# Altium schematic sheet 5.Teensy.SchDoc
size A; DocumentNumber: 5; SheetNumber: 5; SheetTotal: 6
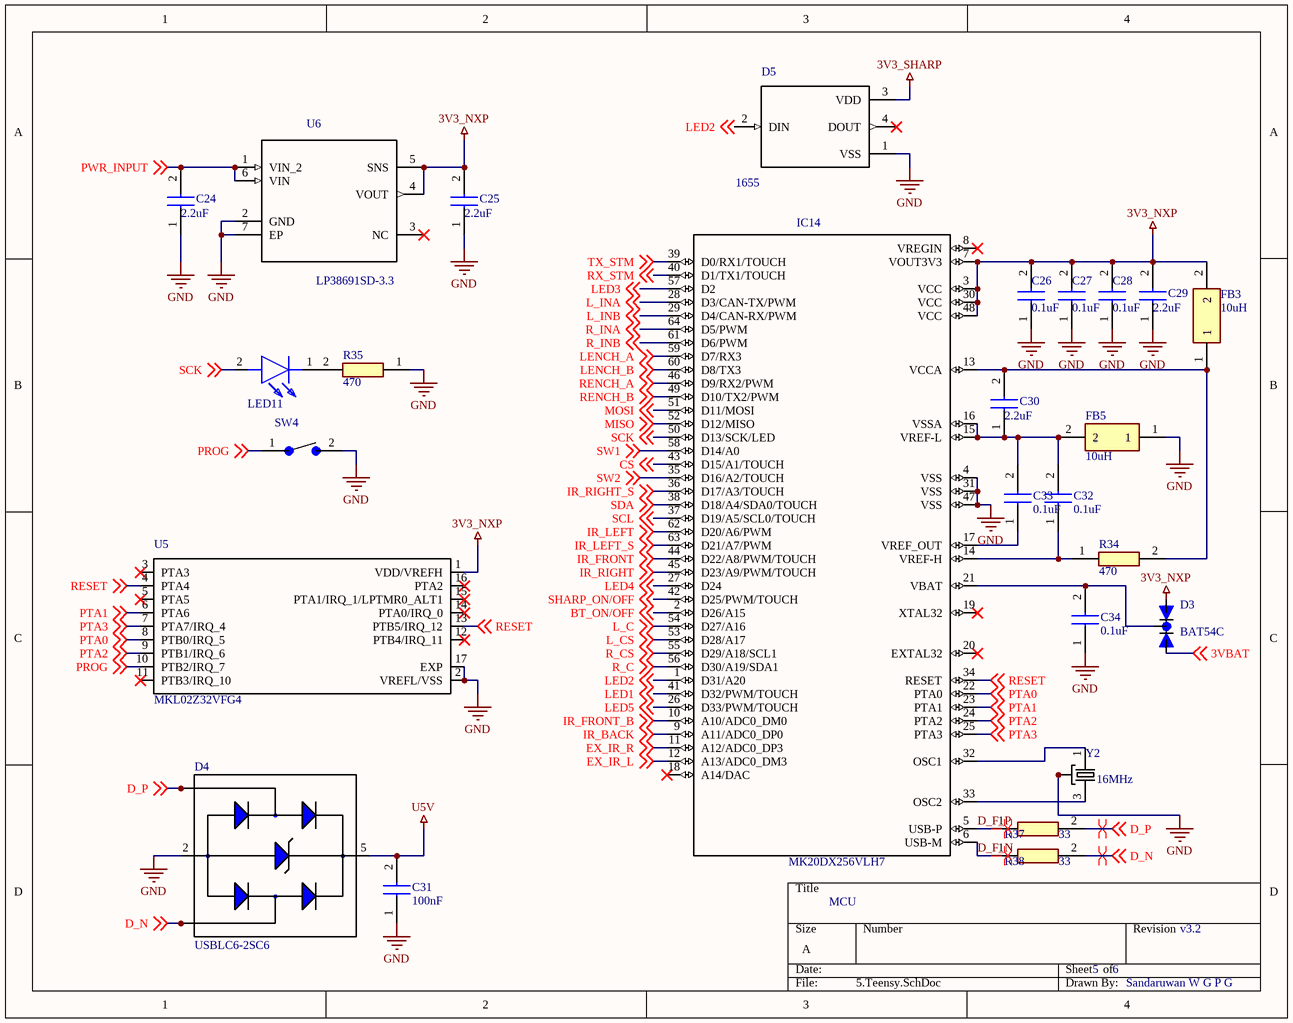
[diagram p0: 5.Teensy.SchDoc]

## Parts
C24  value 2.2uF  [CAPC2012X94N]  (hidden comment: 08055A101JAT2A)
C25  value 2.2uF  [CAPC2012X94N]  (hidden comment: 08055A101JAT2A)
C26  value 0.1uF  [*CAPC1608X95N]  (hidden comment: capacitor 0603)
C27  value 0.1uF  [*CAPC1608X95N]  (hidden comment: capacitor 0603)
C28  value 0.1uF  [*CAPC1608X95N]  (hidden comment: capacitor 0603)
C29  value 2.2uF  [CAPC2012X94N]  (hidden comment: 08055A101JAT2A)
C30  value 2.2uF  [CAPC2012X94N]  (hidden comment: 08055A101JAT2A)
C31  value 100nF  [*CAPC1608X95N]  (hidden comment: capacitor 0603)
C32  value 0.1uF  [*CAPC1608X95N]  (hidden comment: capacitor 0603)
C33  value 0.1uF  [*CAPC1608X95N]  (hidden comment: capacitor 0603)
C34  value 0.1uF  [*CAPC1608X95N]  (hidden comment: capacitor 0603)
D3  BAT54C  [*SOT23-R]
D4  USBLC6-2SC6  [*SOT95P280X145-6N]
D5  1655  [*LED_1655]
FB3  value 10uH  [BEADC1608X95N]  (hidden comment: inductor 0603)
FB5  value 10uH  [BEADC1608X95N]  (hidden comment: inductor 0603)
IC14  MK20DX256VLH7  [QFP50P1200X1200X160-64N]
LED11  150080BS75000  [LEDC2012X80N]  (value not drawn)
R34  value 470  [RESC1608X55N]  (hidden comment: resistor)
R35  value 470  [RESC1608X55N]  (hidden comment: resistor)
R37  value 33  [RESC1608X55N]  (hidden comment: resistor)
R38  value 33  [RESC1608X55N]  (hidden comment: resistor)
SW4  1437566-3  [*TE_FSMSM]  (value not drawn)
U5  MKL02Z32VFG4  [*QFN50P300X300X65-17N]
U6  LP38691SD-3.3  [*DFN300X300X80-7N]
Y2  value 16MHz  [*OSCCC320X250X60N]  (hidden comment: NX3225SA-12.000M-STD-CRS-2)

## Nets
3V3_NXP: C25.2 C26.2 C27.2 C28.2 C29.2 D3.2(A2) FB3.2 IC14.3(VCC) IC14.7(VOUT3V3) IC14.30(VCC) IC14.48(VCC) U5.1(VDD/VREFH) U6.4(VOUT) U6.5(SNS)
3V3_SHARP: D5.3(VDD)
GND: C24.1 C25.1 C26.1 C27.1 C28.1 C29.1 C31.1 C34.1 D4.2(GND) D5.1(VSS) FB5.1 IC14.4(VSS) IC14.31(VSS) IC14.47(VSS) R35.1 SW4.2 U5.2(VREFL/VSS) U5.17(EXP) U6.2(GND) U6.7(EP) Y2.2(GND) Y2.4(GND)
U5V: C31.2 D4.5(VBUS)
3VBAT: D3.1(A1) ; off-sheet 3VBAT
BT_ON/OFF: IC14.2(D26/A15) ; off-sheet BT_ON/OFF
CS: IC14.43(D15/A1/TOUCH) ; off-sheet CS
D_F_N: IC14.6(USB-M) R38.1
D_F_P: IC14.5(USB-P) R37.1
D_N: D4.3(I/O2) D4.4(I/O2) R38.2 ; off-sheet D_N
D_P: D4.1(I/O1) D4.6(I/O1) R37.2 ; off-sheet D_P
EX_IR_L: IC14.12(A13/ADC0_DM3) ; off-sheet EX_IR_L
EX_IR_R: IC14.11(A12/ADC0_DP3) ; off-sheet EX_IR_R
IR_BACK: IC14.9(A11/ADC0_DP0) ; off-sheet IR_BACK
IR_FRONT: IC14.44(D22/A8/PWM/TOUCH) ; off-sheet IR_FRONT
IR_FRONT_B: IC14.10(A10/ADC0_DM0) ; off-sheet IR_FRONT_B
IR_LEFT: IC14.62(D20/A6/PWM) ; off-sheet IR_LEFT
IR_LEFT_S: IC14.63(D21/A7/PWM) ; off-sheet IR_LEFT_S
IR_RIGHT: IC14.45(D23/A9/PWM/TOUCH) ; off-sheet IR_RIGHT
IR_RIGHT_S: IC14.36(D17/A3/TOUCH) ; off-sheet IR_RIGHT_S
L_C: IC14.54(D27/A16) ; off-sheet L_C
L_CS: IC14.53(D28/A17) ; off-sheet L_CS
L_INA: IC14.28(D3/CAN-TX/PWM) ; off-sheet L_INA
L_INB: IC14.29(D4/CAN-RX/PWM) ; off-sheet L_INB
LED1: IC14.41(D32/PWM/TOUCH) ; off-sheet LED1
LED2: D5.2(DIN) IC14.1(D31/A20) ; off-sheet LED2
LED3: IC14.57(D2) ; off-sheet LED3
LED4: IC14.27(D24) ; off-sheet LED4
LED5: IC14.26(D33/PWM/TOUCH) ; off-sheet LED5
LENCH_A: IC14.59(D7/RX3) ; off-sheet LENCH_A
LENCH_B: IC14.60(D8/TX3) ; off-sheet LENCH_B
MISO: IC14.52(D12/MISO) ; off-sheet MISO
MOSI: IC14.51(D11/MOSI) ; off-sheet MOSI
PROG: SW4.1 U5.10(PTB2/IRQ_7) ; off-sheet PROG
PTA0: IC14.22(PTA0) U5.8(PTB0/IRQ_5) ; off-sheet PTA0
PTA1: IC14.23(PTA1) U5.6(PTA6) ; off-sheet PTA1
PTA2: IC14.24(PTA2) U5.9(PTB1/IRQ_6) ; off-sheet PTA2
PTA3: IC14.25(PTA3) U5.7(PTA7/IRQ_4) ; off-sheet PTA3
PWR_INPUT: C24.2 U6.1(VIN_2) U6.6(VIN) ; off-sheet PWR_INPUT
R_C: IC14.56(D30/A19/SDA1) ; off-sheet R_C
R_CS: IC14.55(D29/A18/SCL1) ; off-sheet R_CS
R_INA: IC14.64(D5/PWM) ; off-sheet R_INA
R_INB: IC14.61(D6/PWM) ; off-sheet R_INB
RENCH_A: IC14.46(D9/RX2/PWM) ; off-sheet RENCH_A
RENCH_B: IC14.49(D10/TX2/PWM) ; off-sheet RENCH_B
RESET: IC14.34(RESET) U5.4(PTA4) U5.13(PTB5/IRQ_12) ; off-sheet RESET
RX_STM: IC14.40(D1/TX1/TOUCH) ; off-sheet RX_STM
SCK: IC14.50(D13/SCK/LED) LED11.2(A) ; off-sheet SCK
SCL: IC14.37(D19/A5/SCL0/TOUCH) ; off-sheet SCL
SDA: IC14.38(D18/A4/SDA0/TOUCH) ; off-sheet SDA
SHARP_ON/OFF: IC14.42(D25/PWM/TOUCH) ; off-sheet SHARP_ON/OFF
SW1: IC14.58(D14/A0) ; off-sheet SW1
SW2: IC14.35(D16/A2/TOUCH) ; off-sheet SW2
TX_STM: IC14.39(D0/RX1/TOUCH) ; off-sheet TX_STM
NetC30_1: C30.1 C32.2 C33.2 FB5.2 IC14.15(VREF-L) IC14.16(VSSA)
NetC30_2: C30.2 FB3.1 IC14.13(VCCA) R34.2
NetC32_1: C32.1 IC14.14(VREF-H) R34.1
NetC33_1: C33.1 IC14.17(VREF_OUT)
NetC34_2: C34.2 D3.3(C) IC14.21(VBAT)
NetIC14_32: IC14.32(OSC1) Y2.1
NetIC14_33: IC14.33(OSC2) Y2.3
NetLED11_1: LED11.1(K) R35.2

Not connected (* = marked no-connect by the designer): D5 4(DOUT)*; IC14 8(VREGIN)* 18(A14/DAC)* 19(XTAL32)* 20(EXTAL32)*; U5 3(PTA3)* 5(PTA5)* 11(PTB3/IRQ_10)* 12(PTB4/IRQ_11)* 14(PTA0/IRQ_0)* 15(PTA1/IRQ_1/LPTMR0_ALT1)* 16(PTA2)*; U6 3(NC)*

## Layout directives
differential pair: D_F_N, D_F_P, D_N, D_P

## Notes on the sheet
- MCU
- v3.2
- Sandaruwan W G P G

## Library data of the parts
C24 C25 C29 C30 = 08055A101JAT2A: Capacitor; Manufacturer_Name: AVX; Allied_Number: 70474488; Datasheet Link: https://componentsearchengine.com/Datasheets/1/06031A100FAT2A.pdf; Height: 0.94mm; Manufacturer_Part_Number: 08055A101JAT2A; Mouser Part Number: 581-08055A101J; Mouser Price/Stock: https://www.mouser.com/Search/Refine.aspx?Keyword=581-08055A101J; RS Part Number: 0391000P; RS Price/Stock: http://uk.rs-online.com/web/p/products/0391000P; Allied Price/Stock: https://www.alliedelec.com/avx-08055a101jat2a/70474488/
C26-C28 C31-C34 = capacitor 0603: Capacitor
D3 = BAT54C: MF: ON Semiconductor; Package: SOT-23-3 ON Semiconductor; Availability: Unavailable; MP: BAT54C; SnapEDA_Link: https://www.snapeda.com/parts/BAT54C/ON%20Semiconductor/view-part/?ref=snap; Price: None; Value: *
D4 = USBLC6-2SC6: USBLC6 Series 2 Line 6 V Uni / Bi-Directional ESD Protection - SOT-23-6; MF: STMicroelectronics; Package: SOT-23-6 STMicroelectronics; Price: None; SnapEDA_Link: https://www.snapeda.com/parts/USBLC6-2SC6/STMicroelectronics/view-part/?ref=snap; MP: USBLC6-2SC6; Availability: Unavailable; Value: *
D5 = 1655: Addressable Lighting Neopixel 10 LED Discrete Serial _Shift Register_ Red, Green, Blue _RGB_ 5.00mm L x 5.00mm W; MF: Adafruit; Digi-Key_Part_Number: 1528-1104-ND; MP: 1655; Package: TO-3 Adafruit; SnapEDA_Link: https://www.snapeda.com/parts/1655/Adafruit%20Industries/view-part/4299409/?ref=snap; Digi-Key_Purchase_URL: https://www.digikey.lk/product-detail/en/adafruit-industries-llc/1655/1528-1104-ND/5154679?utm_source=snapeda&utm_medium=aggregator&utm_campaign=symbol; Value: *
FB3 FB5 = inductor 0603: Ferrite Bead
IC14 = MK20DX256VLH7_1: Kinetis K20: 72MHz Cortex-M4 Performance MCU, 288KB Flash, 64KB SRAM, Full-Speed USB, 64-LQFP; MF: NXP USA; Package: LQFP-64 NXP Semiconductors; Availability: Unavailable; MP: MK20DX256VLH7; SnapEDA_Link: https://www.snapeda.com/parts/MK20DX256VLH7/NXP%20USA%20Inc./view-part/?ref=snap; Price: None; Value: *
LED11 = 150080BS75000: LED; Manufacturer_Name: Wurth Elektronik; Datasheet Link: https://katalog.we-online.com/led/datasheet/150080BS75000.pdf; Height: 0.8mm; Manufacturer_Part_Number: 150080BS75000; Mouser Part Number: 710-150080BS75000; Mouser Price/Stock: https://www.mouser.com/Search/Refine.aspx?Keyword=710-150080BS75000; RS Part Number: 8154228P; RS Price/Stock: http://uk.rs-online.com/web/p/products/8154228P
SW4 = FSMSM: Switch Tactile OFF _ON_ SPST Rectangular Button Gull Wing 0.05A 12VDC SMD Loose Piece; MF: TE Connectivity; Configuration_Pole-Throw: Single Pole - Single Throw; Contact_Current_Rating: 50 mA; Availability: Unavailable; Price: None; Package: None; SnapEDA_Link: https://www.snapeda.com/parts/FSMSM/TE%20Connectivity%20ALCOSWITCH%20Switches/view-part/?ref=snap; MP: FSMSM; TE_purchase_URL: https://www.te.com/usa-en/product-1437566-3.html?te_bu=Cor&te_type=disp&te_campaign=seda_glo_cor-seda-global-disp-prtnr-fy19-seda-model-bom-cta_sma-317_1&elqCampaignId=32493; Value: *
U5 = MKL02Z32VFG4_1: 32 Bit Microcontroller, Kinetis L Series Ultra Low Power, ARM Cortex-M0+, 48 MHz, 32 KB, 4 KB, 16; MF: NXP USA; Package: QFN-16 NXP Semiconductors; Availability: Unavailable; MP: MKL02Z32VFG4; SnapEDA_Link: https://www.snapeda.com/parts/MKL02Z32VFG4/NXP%20USA%20Inc./view-part/?ref=snap; Price: None; Value: *
U6 = LP38691SD-3.3: 500mA Low Dropout CMOS Linear Regulators Stable with Ceramic Output Capacitors 6-WSON -40 to 125; MF: Texas Instruments; MP: LP38691SD-3.3; Price: None; SnapEDA_Link: https://www.snapeda.com/parts/LP38691SD-3.3/Texas%20Instruments/view-part/?ref=snap; Availability: Unavailable; Package: WDFN-6 Texas Instruments; Value: *
Y2 = NX3225SA-12.000M-STD-CRS-2: Crystal 12.0000mhz 8pf Smd; MF: NDK America,; MP: NX3225SA-12.000M-STD-CRS-2; Price: None; SnapEDA_Link: https://www.snapeda.com/parts/NX3225SA-12.000M-STD-CRS-2/NDK%20America%2C%20Inc./view-part/?ref=snap; Availability: Unavailable; Package: SMD-4 NDK America